# Altium project PCB_Project.PrjPcb
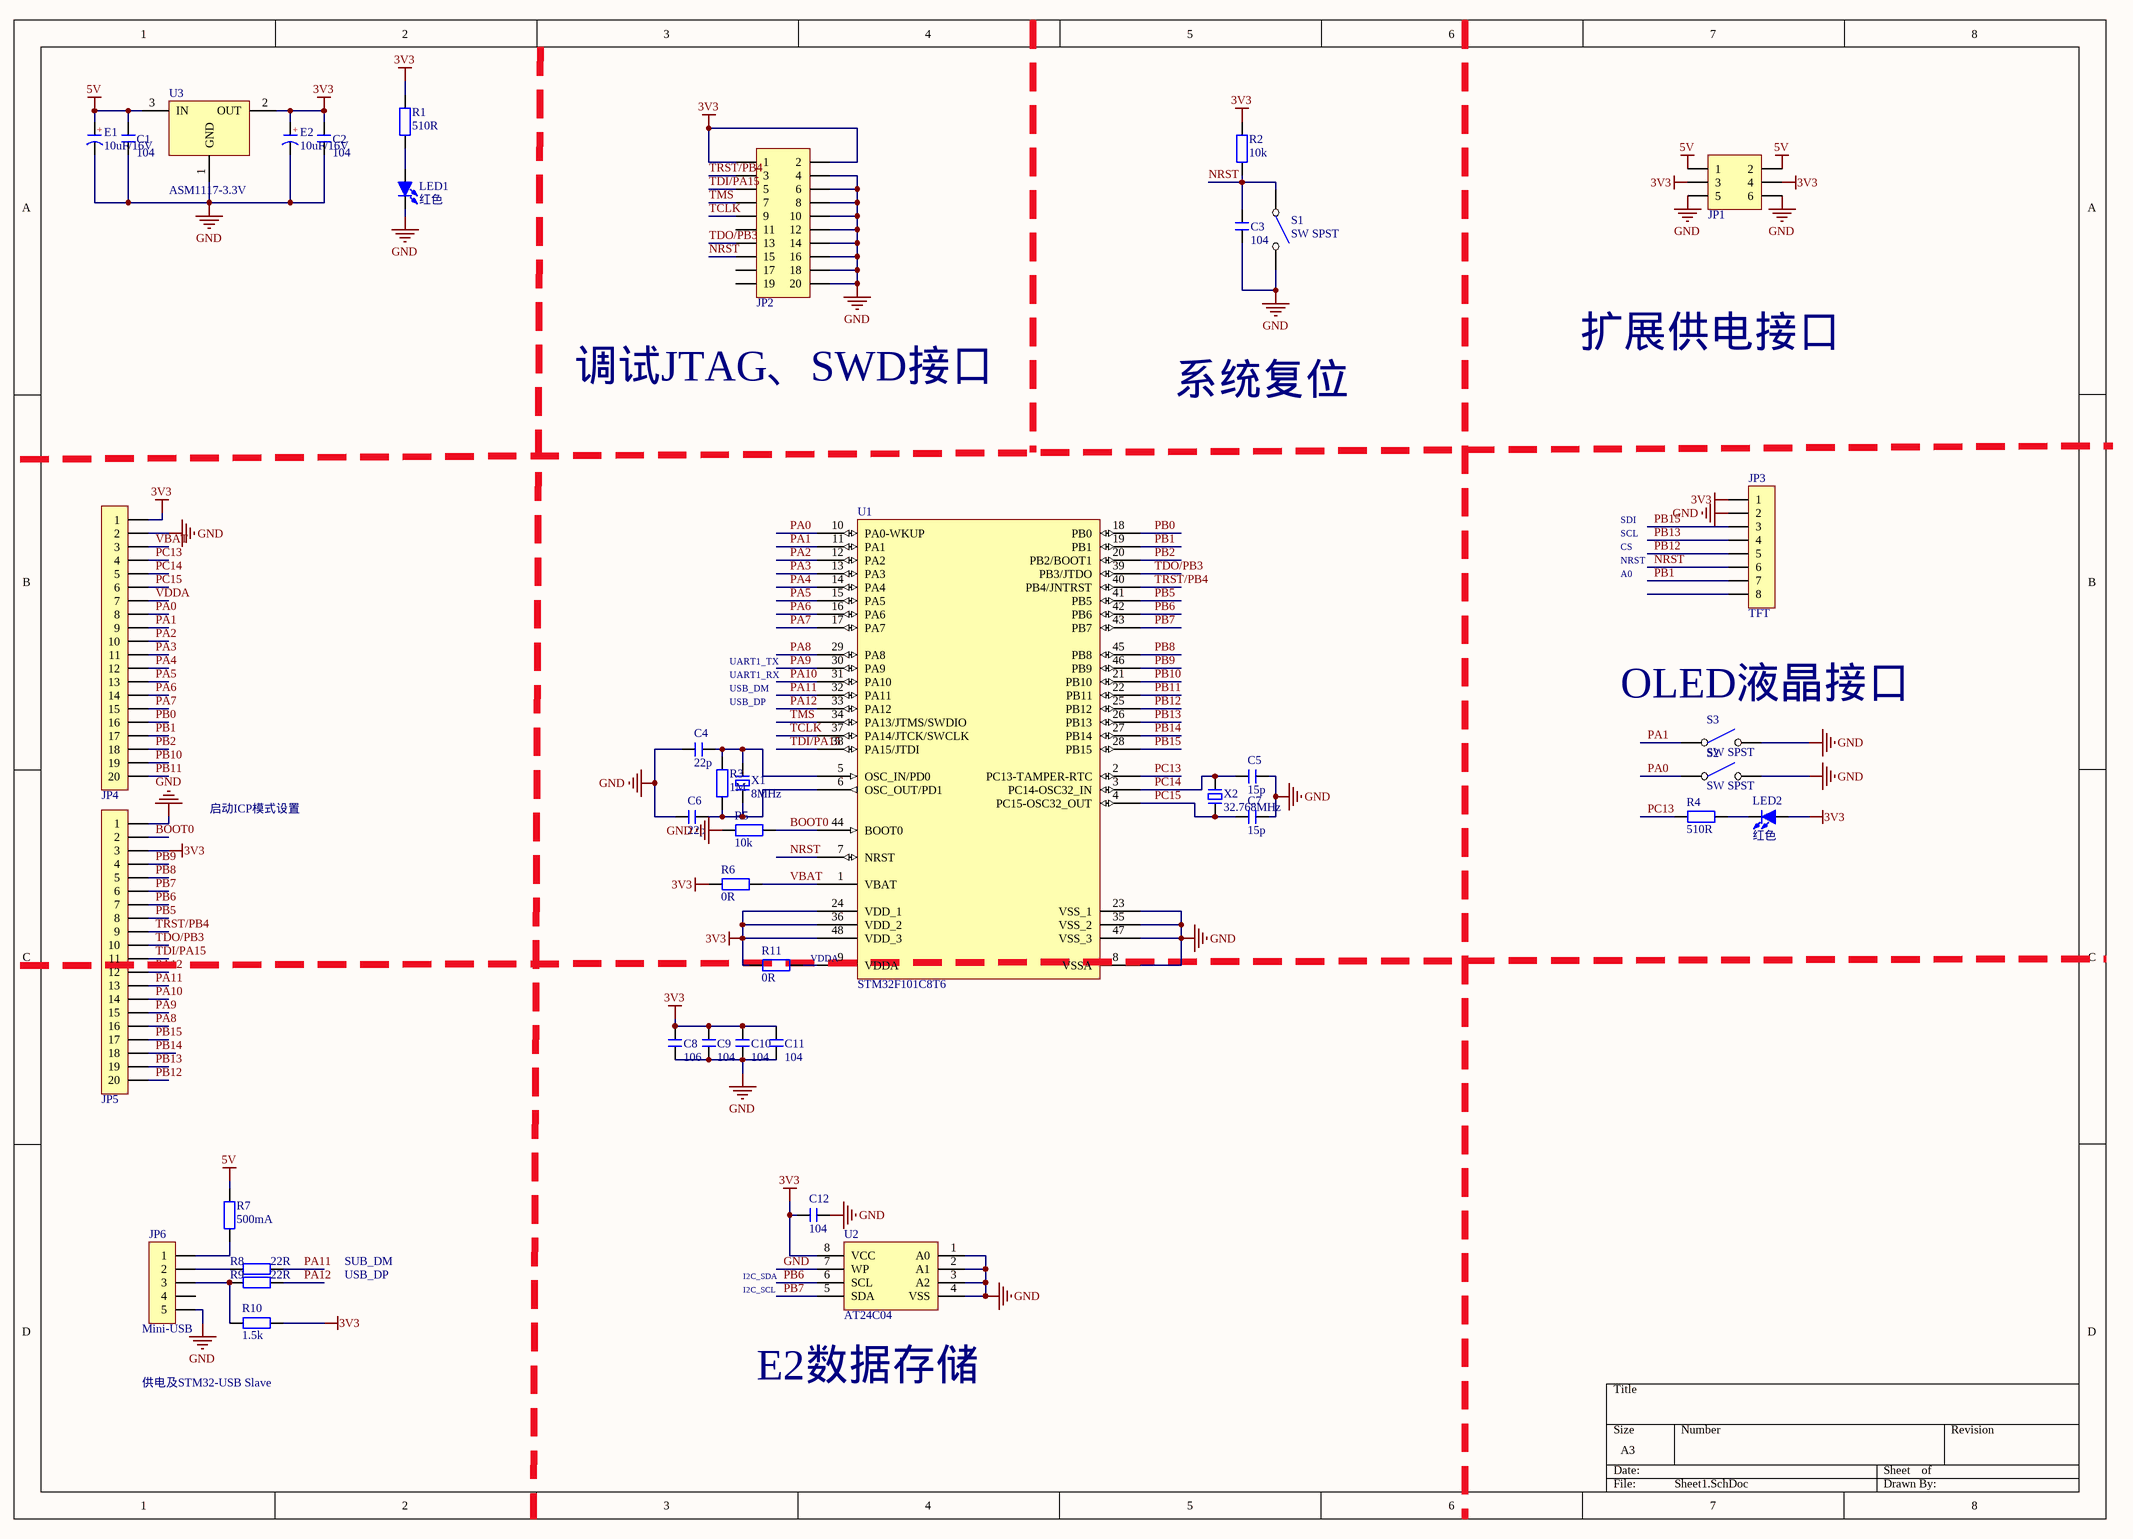
[diagram p0: Sheet1.SchDoc]
1 sheet, 41 parts. Net scope: global (net labels, ports and power ports of the same name join across sheets).
Board files: PCB1.PcbDoc, 拼板.PcbDoc, PCB2.PcbDoc

## Sheet Sheet1.SchDoc
size A3

### Parts
C1  104  [C 0805_M]
C2  104  [C 0805_M]
C3  104  [C 0805_M]
C4  22p  [C 0805_M]
C5  15p  [C 0805_M]
C6  22p  [C 0805_M]
C7  15p  [C 0805_M]
C8  106  [C 0805_M]
C9  104  [C 0805_M]
C10  104  [C 0805_M]
C11  104  [C 0805_M]
C12  104  [C 0805_M]
E1  10uF/16V  [C 0805_M]
E2  10uF/16V  [C 0805_M]
JP1  Header3X2  [HDR2.54-LI-2x3P]  (value not drawn)
JP2  Header 2X10  [HDR2.54-LI-2x10P]  (value not drawn)
JP3  TFT  [HDR2.54-LI-8P]
JP4  HDR-1X20  [HDR2.54-LI-20P]  (value not drawn)
JP5  HDR-1X20  [HDR2.54-LI-20P]  (value not drawn)
JP6  Mini-USB  [USB-micro_A]
LED1  红色  [LED 0805Y]
LED2  红色  [LED 0805G]
R1  510R  [R 0805_M]
R2  10k  [R 0805_M]
R3  1M  [R 0805_M]
R4  510R  [R 0805_M]
R5  10k  [R 0805_M]
R6  0R  [R 0805_M]
R7  500mA  [R 0805_M]
R8  22R  [R 0805_M]
R9  22R  [R 0805_M]
R10  1.5k  [R 0805_M]
R11  0R  [R 0805_M]
S1  SW SPST  [KFC DIP-7X7]
S2  SW SPST  [TSW SMD-3*6*5]
S3  SW SPST  [TSW SMD-3*6*5]
U1  STM32F101C8T6  [LQFP48_M]
U2  AT24C04  [SSOP8_M]
U3  ASM1117-3.3V  [SOT230P700-4L]
X1  8MHz  [OSC HC-49U]
X2  32.768MHz  [OSC-3x10-WI-A]

### Nets
3V3: C2.2 C8.1 C9.1 C10.1 C11.1 C12.1 E2.1(A) JP1.3 JP1.4 JP2.1 JP2.2 JP3.1 JP4.1 JP5.3 LED2.1(A) R1.2 R2.2 R6.2 R10.1 R11.2 U1.24(VDD_1) U1.36(VDD_2) U1.48(VDD_3) U2.8(VCC) U3.2(OUT)
5V: C1.2 E1.1(A) JP1.1 JP1.2 R7.2 U3.3(IN)
GND: C1.1 C2.1 C3.1 C4.1 C5.1 C6.1 C7.1 C8.2 C9.2 C10.2 C11.2 C12.2 E1.2(K) E2.2(K) JP1.5 JP1.6 JP2.4 JP2.6 JP2.8 JP2.10 JP2.12 JP2.14 JP2.16 JP2.18 JP2.20 JP3.2 JP4.2 JP5.1 JP6.5 LED1.2(K) R5.2 S1.2(NO) S2.2(NO) S3.2(NO) U1.8(VSSA) U1.23(VSS_1) U1.35(VSS_2) U1.47(VSS_3) U2.1(A0) U2.2(A1) U2.3(A2) U2.4(VSS) U2.7(WP) U3.1(GND)
BOOT0: JP5.2 R5.1 U1.44(BOOT0)
NRST: C3.2 JP2.15 JP3.6 R2.1 S1.1(COMMON) U1.7(NRST)
PA0: JP4.8 S2.1(COMMON) U1.10(PA0-WKUP)
PA1: JP4.9 S3.1(COMMON) U1.11(PA1)
PA2: JP4.10 U1.12(PA2)
PA3: JP4.11 U1.13(PA3)
PA4: JP4.12 U1.14(PA4)
PA5: JP4.13 U1.15(PA5)
PA6: JP4.14 U1.16(PA6)
PA7: JP4.15 U1.17(PA7)
PA8: JP5.16 U1.29(PA8)
PA9: JP5.15 U1.30(PA9)
PA10: JP5.14 U1.31(PA10)
PA11: JP5.13 R8.1 U1.32(PA11)
PA12: JP5.12 R9.1 U1.33(PA12)
PB0: JP4.16 U1.18(PB0)
PB1: JP3.7 JP4.17 U1.19(PB1)
PB2: JP4.18 U1.20(PB2/BOOT1)
PB5: JP5.8 U1.41(PB5)
PB6: JP5.7 U1.42(PB6) U2.6(SCL)
PB7: JP5.6 U1.43(PB7) U2.5(SDA)
PB8: JP5.5 U1.45(PB8)
PB9: JP5.4 U1.46(PB9)
PB10: JP4.19 U1.21(PB10)
PB11: JP4.20 U1.22(PB11)
PB12: JP3.5 JP5.20 U1.25(PB12)
PB13: JP3.4 JP5.19 U1.26(PB13)
PB14: JP5.18 U1.27(PB14)
PB15: JP3.3 JP5.17 U1.28(PB15)
PC13: JP4.4 R4.2 U1.2(PC13-TAMPER-RTC)
PC14: C5.2 JP4.5 U1.3(PC14-OSC32_IN) X2.1
PC15: C7.2 JP4.6 U1.4(PC15-OSC32_OUT) X2.2
TCLK: JP2.9 U1.37(PA14/JTCK/SWCLK)
TDI/PA15: JP2.5 JP5.11 U1.38(PA15/JTDI)
TDO/PB3: JP2.13 JP5.10 U1.39(PB3/JTDO)
TMS: JP2.7 U1.34(PA13/JTMS/SWDIO)
TRST/PB4: JP2.3 JP5.9 U1.40(PB4/JNTRST)
VBAT: JP4.3 R6.1 U1.1(VBAT)
VDDA: JP4.7 R11.1 U1.9(VDDA)
NetC4_2: C4.2 R3.1 U1.5(OSC_IN/PD0) X1.2
NetC6_2: C6.2 R3.2 U1.6(OSC_OUT/PD1) X1.1
NetJP6_1: JP6.1 R7.1
NetJP6_2: JP6.2 R8.2
NetJP6_3: JP6.3 R9.2 R10.2
NetLED1_1: LED1.1(A) R1.1
NetLED2_2: LED2.2(K) R4.1

Not connected (* = marked no-connect by the designer): JP2 11 17 19; JP3 8; JP6 4

### Notes on the sheet
- 调试JTAG、SWD接口
- 扩展供电接口
- 系统复位
- SDI
- SCL
- CS
- NRST
- A0
- (near S3) OLED液晶接口
- 启动ICP模式设置
- SUB_DM
- USB_DP
- I2C_SDA
- I2C_SCL
- 供电及STM32-USB Slave
- (near U2) E2数据存储
- Labels drawn without touching a wire or pin: UART1_RX, UART1_TX, USB_DM, USB_DP
- (in symbol C-CAP) +

### Library data of the parts
C1-C12 = C: 无极性贴片电容; 版权归属: 源创客; 材质: X7R; BOM名称: 无极性贴片电容; 学习资源: www.ooocke.com
E1 E2 = C-CAP: 直插电解电容; 版权归属: 源创客; BOM名称: 直插电解电容; 学习资源: www.ooocke.com
JP1 = Header 3X2: 3*2P接插件; 版权归属: 源创客; BOM名称: 3*2P接插件; 学习资源: www.ooocke.com
JP2 = Header 10X2: 10*2P接插件; 版权归属: 源创客; BOM名称: 10*2P接插件; 学习资源: www.ooocke.com
JP3 = Header 8: 8P接插件; 版权归属: 源创客; BOM名称: 8P接插件; 学习资源: www.ooocke.com
JP4 JP5 = Header 20: 20P接插件; 版权归属: 源创客; BOM名称: 20P接插件; 学习资源: www.ooocke.com
JP6 = Header 5: 5P接插件; 版权归属: 源创客; BOM名称: 5P接插件; 学习资源: www.ooocke.com
LED1 LED2 = LED-SMD: 贴片LED; 版权归属: 源创客; BOM名称: 贴片LED; 学习资源: www.ooocke.com
R1-R11 = R: 贴片电阻; 版权归属: 源创客; BOM名称: 贴片电阻; 学习资源: www.ooocke.com
U1 = STM32F101C8T6: STM32 ARM-based 32-bit MCU with 64 Kbytes Flash, 48-pin LQFP, Industrial Temperature; Published: 30-May-2008; DatasheetVersion: rev6, Mar-2008; PackageVersion: Mar-2008; PackageReference: LQFP48; Publisher: Altium Limited; PackageDescription: 48-Pin Low-Profile Quad Flat Pack, 7 x 7 mm Body, 0.5 mm Pitch (LQFP48); ComponentLink1Description: Manufacturer Link; ComponentLink1URL: www.st.com/stm32; ComponentLink2Description: Datasheet; ComponentLink2URL: http://www.st.com/stonline/products/literature/ds/13586.pdf
U3 = ASM1117-3.3V: 三端可调或固定电压3.3V
X1 X2 = XTAL-2P: 2脚无源脚晶振; 版权归属: 源创客; 负载电容: CL20pF; BOM名称: 2脚无源脚晶振; 学习资源: www.ooocke.com